# EAGLE design radio_r3 (EAGLE 9.6.2)
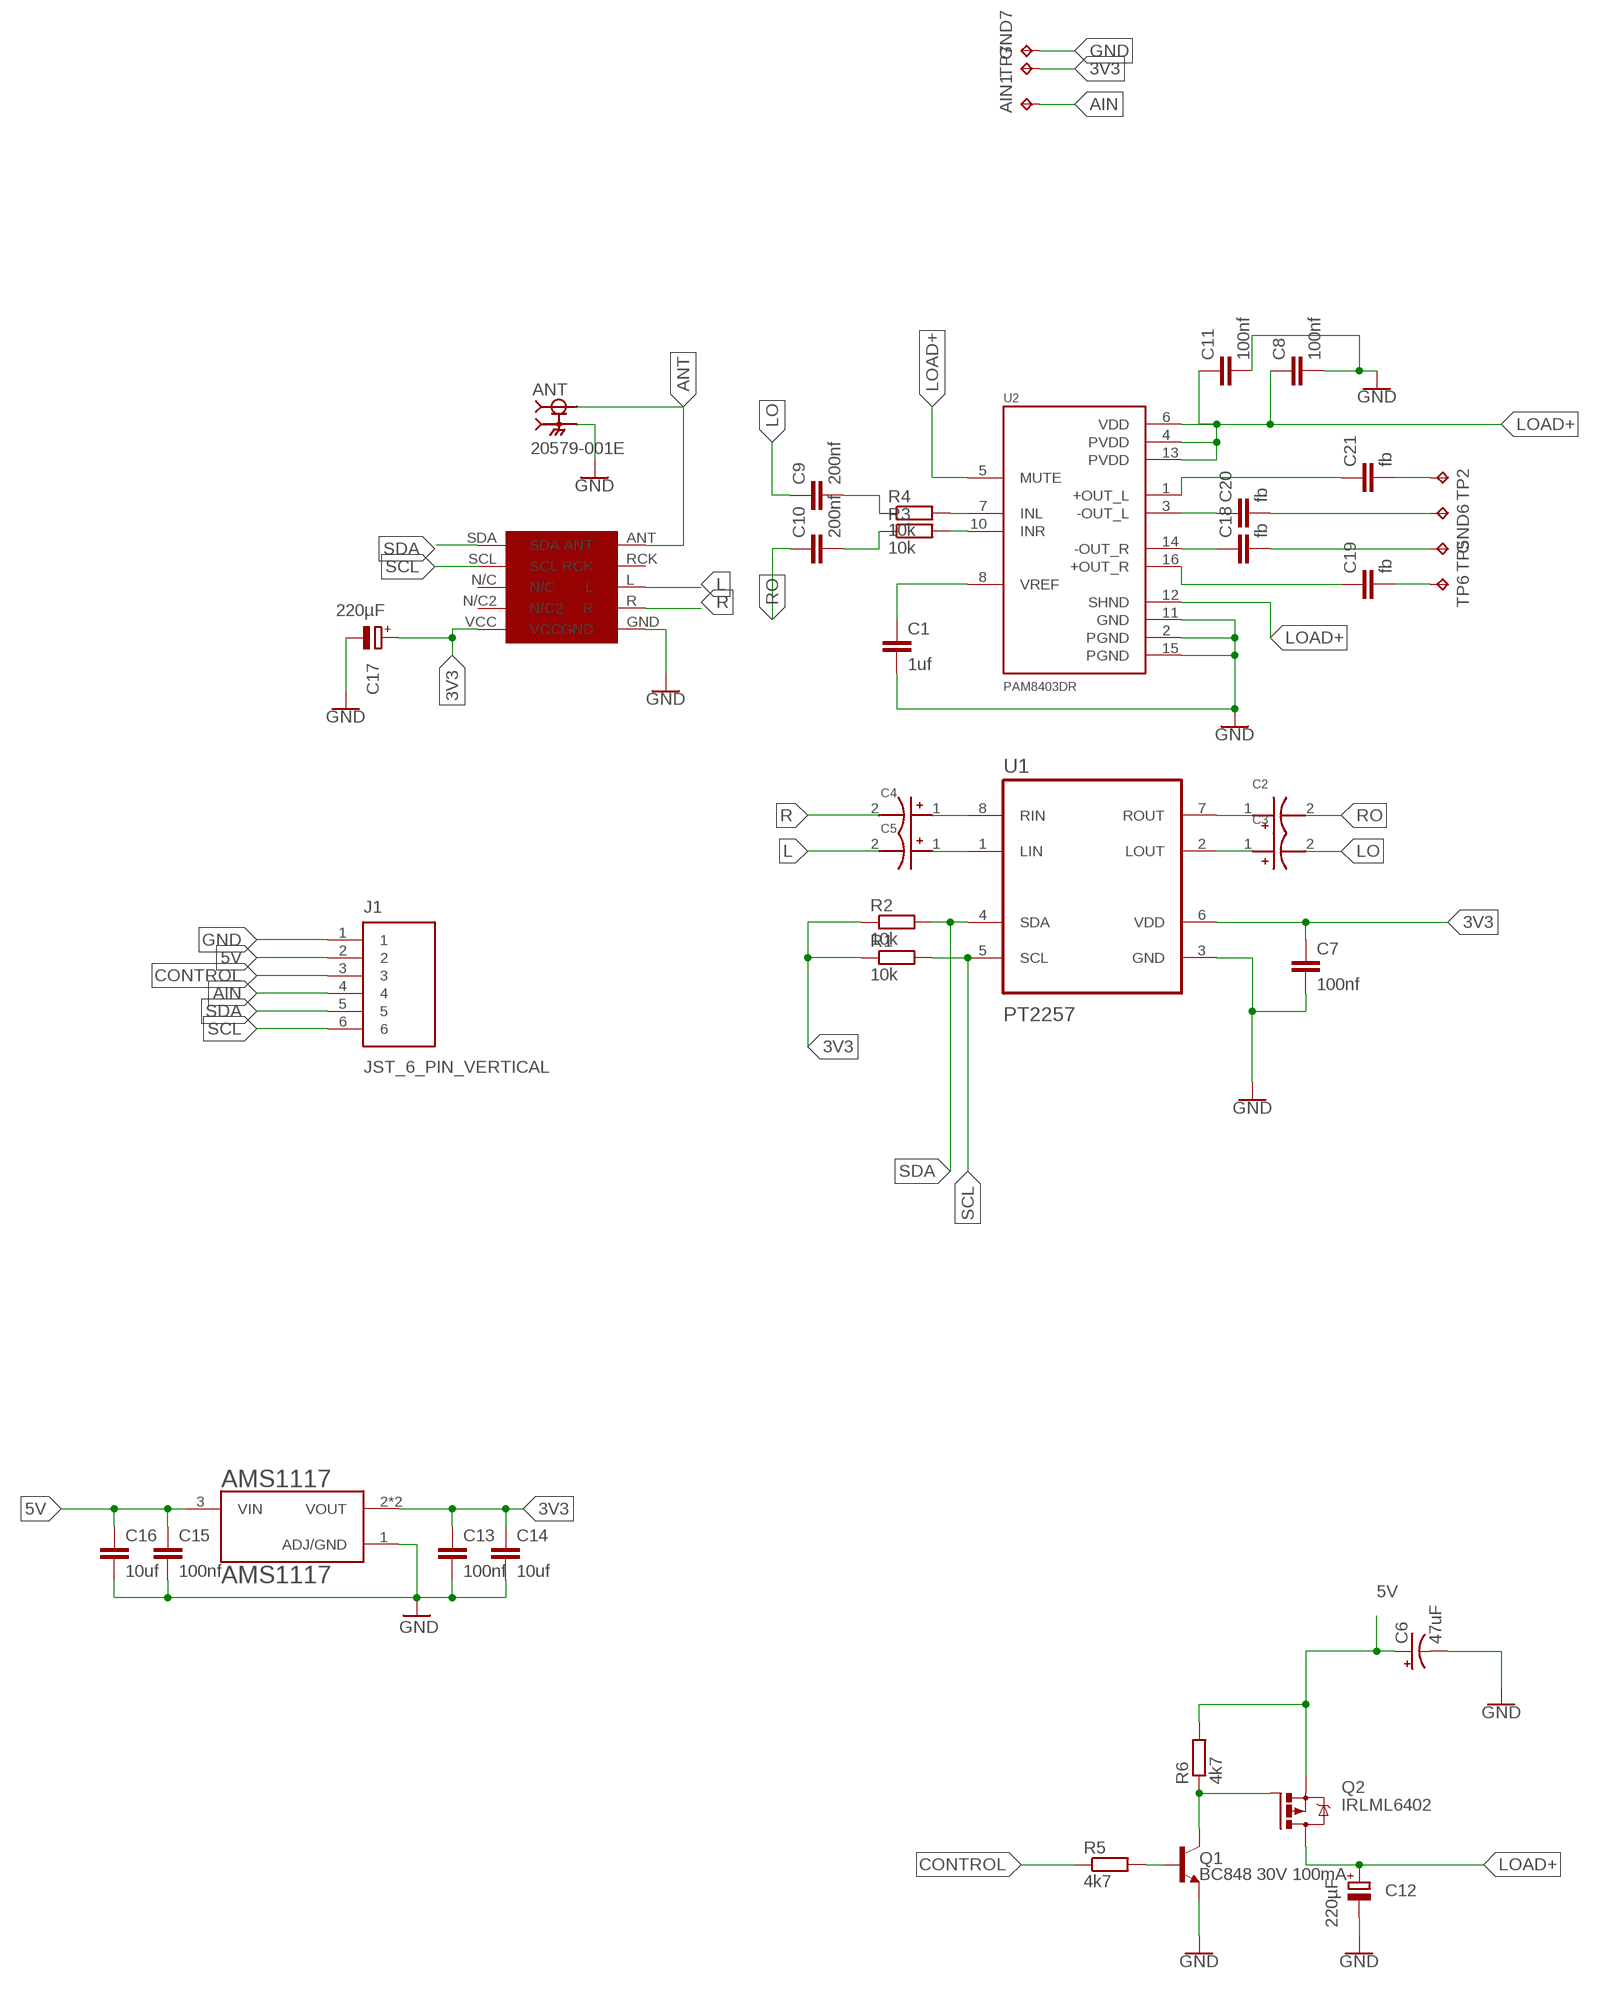
[diagram p0: schematic, sheet 1]

## Parts
AIN1  TPTP10SQ  [TP10SQ]
AMS1117  AMS1117  [SOT229P700X180-4N]
ANT  20579-001E  [IPEX_20579-001E]
C1  1uf  C-EUC0805  [C0805]
C2  10uf  TAJA106M010RNJ  [CAPMP3216X180N]
C3  10uf  TAJA106M010RNJ  [CAPMP3216X180N]
C4  10uf  TAJA106M010RNJ  [CAPMP3216X180N]
C5  10uf  TAJA106M010RNJ  [CAPMP3216X180N]
C6  47uF  47UF-POLAR-EIA3528-10V-10%  [EIA3528]
C7  100nf  C-EUC0603  [C0603]
C8  100nf  C-EUC0805  [C0805]
C9  200nf  C-EUC0805  [C0805]
C10  200nf  C-EUC0805  [C0805]
C11  100nf  C-EUC0805  [C0805]
C12  220µF  CPOL-EUD  [PANASONIC_D]
C13  100nf  C-EUC0603  [C0603]
C14  10uf  C-EUC0805  [C0805]
C15  100nf  C-EUC0603  [C0603]
C16  10uf  C-EUC0805  [C0805]
C17  220µF  CPOL-EUD  [PANASONIC_D]
C18  fb  C-EUC0805  [C0805]
C19  fb  C-EUC0805  [C0805]
C20  fb  C-EUC0805  [C0805]
C21  fb  C-EUC0805  [C0805]
GND6  TPTP15R  [TP15R]
GND7  TPTP10SQ  [TP10SQ]
J1  JST_6_PIN_VERTICAL  [JST-6-SMD-VERT-1.0MM]
Q1  BC848 30V 100mA  TRANS_NPN-MMBT2222AL  [SOT23-3]
Q2  IRLML6402  IRLML5203  [MICRO3]
R1  10k  R-EU_R0603  [R0603]
R2  10k  R-EU_R0603  [R0603]
R3  10k  R-EU_R0805  [R0805]
R4  10k  R-EU_R0805  [R0805]
R5  4k7  R-EU_R0603  [R0603]
R6  4k7  R-EU_R0603  [R0603]
RDA5807M  RDA  [RDA]
TP2  TPTP15R  [TP15R]
TP5  TPTP15R  [TP15R]
TP6  TPTP15R  [TP15R]
TP7  TPTP10SQ  [TP10SQ]
U1  PT2257  [SOIC127P600X175-8N]
U2  PAM8403DR  [SOIC127P605X150-16N]

## Nets
3V3: AMS1117.2(VOUT) AMS1117.4(VOUT) C7.1 C13.1 C14.1 C17.+ R1.1 R2.1 RDA5807M.VCC TP7.TP U1.6(VDD)
5V: AMS1117.3(VIN) C6.A(+) C15.1 C16.1 J1.2 Q2.2(S) R6.2
AIN: AIN1.TP J1.4
ANT: ANT.1(SIGNAL) RDA5807M.ANT
CONTROL: J1.3 R5.1
GND: AMS1117.1(ADJ/GND) ANT.G1(GROUND) ANT.G2(GROUND) ANT.G3(GROUND) C1.2 C6.C(-) C7.2 C8.2 C11.2 C12.- C13.2 C14.2 C15.2 C16.2 C17.- GND7.TP J1.1 Q1.2(E) RDA5807M.GND U1.3(GND) U2.2(PGND) U2.11(GND) U2.15(PGND)
L: C5.2 RDA5807M.L
LO: C3.2 C9.1
LOAD+: C8.1 C11.1 C12.+ Q2.3(D) U2.4(PVDD) U2.5(MUTE) U2.6(VDD) U2.12(SHND) U2.13(PVDD)
N$1: Q1.1(B) R5.2
N$2: Q1.3(C) Q2.1(G) R6.1
N$3: C2.1 U1.7(ROUT)
N$4: C3.1 U1.2(LOUT)
N$5: C1.1 U2.8(VREF)
N$6: C21.1 U2.1(+OUT_L)
N$7: C4.1 U1.8(RIN)
N$8: C5.1 U1.1(LIN)
N$9: C20.1 U2.3(-OUT_L)
N$10: C18.1 U2.14(-OUT_R)
N$11: C19.1 U2.16(+OUT_R)
N$12: R4.2 U2.7(INL)
N$13: R3.2 U2.10(INR)
N$14: C9.2 R4.1
N$15: C10.2 R3.1
N$16: C19.2 TP6.TP
N$17: C18.2 TP5.TP
N$18: C20.2 GND6.TP
N$19: C21.2 TP2.TP
R: C4.2 RDA5807M.R
RO: C2.2 C10.1
SCL: J1.6 R1.2 RDA5807M.SCL U1.5(SCL)
SDA: J1.5 R2.2 RDA5807M.SDA U1.4(SDA)
Unconnected: RDA5807M.N/C RDA5807M.N/C2 RDA5807M.RCK

## Library data of the parts
AIN1 GND6 GND7 TP2 TP5-TP7 = testpad:TP: Test pad
AMS1117 = AMS1117:AMS1117: Sot223/Pkg 1-Amp 5-Volt Low Drop Out Voltage Regulatator; AVAILABILITY: Unavailable; DESCRIPTION: 1A LOW DROPOUT VOLTAGE REGULATOR SOT-223; MF: Advanced Monolithic Systems; MP: AMS1117; PACKAGE: SOT-223 Seeed Technology; PRICE: None
ANT = 20579-001E:20579-001E: MHF 4L RECEPTACLE Check availability <https://pricing.snapeda.com/parts/20579-001E/I-PEX/view-part?ref=eda>; AVAILABILITY: In Stock; DESCRIPTION: 1 POS Vertical SMD Coaxial connector M.2 industry standard with a mated height of 1.4 mm and support up to 12 GHz MHF 4L Receptacle; MF: I-PEX; MP: 20579-001E; PACKAGE: None; PRICE: None; PURCHASE-URL: https://pricing.snapeda.com/search/part/20579-001E/?ref=eda
C1 C7-C11 C18-C21 = rcl:C-EU: CAPACITOR, European symbol; SPICEPREFIX: C
C2-C5 = TAJA106M010RNJ:TAJA106M010RNJ: 1µF Molded Tantalum Capacitors 16V 1206 (3216 Metric) 11Ohm @ 100kHz Check availability <https://pricing.snapeda.com/parts/TAJA106M010RNJ/AVX/view-part?ref=eda>; AVAILABILITY: In Stock; DESCRIPTION: 10 µF Molded Tantalum Capacitors 10 V 1206 (3216 Metric) 3Ohm; MF: AVX; MP: TAJA106M010RNJ; PACKAGE: 1206 AVX; PRICE: None; PURCHASE-URL: https://pricing.snapeda.com/search/part/TAJA106M010RNJ/?ref=eda
C6 = SparkFun-Capacitors:47UF-POLAR: 47µF polarized capacitors A capacitor is a passive two-terminal electrical component used to store electrical energy temporarily in an electric field.; PROD_ID: CAP-08310
C12 C17 = rcl:CPOL-EU: POLARIZED CAPACITOR, European symbol; SPICEPREFIX: C
C13-C16 = resistor:C-EU: CAPACITOR, European symbol
J1 = SparkFun-Connectors:JST_6_PIN_VERTICAL: JST 6 pin vertical connector Here is a six pin vertical 1.0mm pitch connector. It is useful if you need something very tiny as a connection. These are not the standard JST type connectors we use on most of our boards, but are actually the much smaller JST-SH type. Here is the connector we sell at SparkFun: JST SH Vertical 6-Pin Connector - SMD <https://www.sparkfun.com/products/579> (GPS-00579) Datasheet <http://www.sparkfun.com/datasheets/GPS/EM406-SMDConnector-eSH.pdf> It was used on these SparkFun products: SparkFun GPS Breakout <https://www.sparkfun.com/products/11818> (BOB-11818) SparkFun Weather Shield <https://www.sparkfun.com/products/12081> (DEV-12081) And many, many other GPS related products.; PROD_ID: CONN-08249; SF_ID: GPS-00579
Q1 = SparkFun-DiscreteSemi:TRANS_NPN: NPN transistor Current controlled devices typically used to amplify current or used as a switch. BC547 - COM-08928 <http://www.sparkfun.com/products/8928> (TO-92 45V 100mA) (1.Collector 2.Base 3.Emitter) 2N3904 - COM-00521 <http://www.sparkfun.com/products/521> (TO-92 40V 200mA) (1.Emitter 2.Base 3.Collector) P2N2222A - COM-12852 <http://www.sparkfun.com/products/12852> (TO-92 40V 600mA) (1.Collector 2.Base 3.Emitter); PROD_ID: TRANS-08049; VALUE: 600mA/40V
Q2 = transistor-power:IRLML5203: HEXFET P-Channel Power MOSFET
R1-R6 = resistor:R-EU_: RESISTOR, European symbol
RDA5807M = RDA:RDA
U1 = PT2257:PT2257: Check availability <https://pricing.snapeda.com/parts/NE555PS/Texas%20Instruments/view-part?ref=eda>; AVAILABILITY: In Stock; DESCRIPTION: Single Precision Timer; MF: Texas Instruments; MP: NE555PS; PACKAGE: SOP-8 Texas Instruments; PRICE: None; PURCHASE-URL: https://pricing.snapeda.com/search/part/NE555PS/?ref=eda
U2 = PAM8403DR:PAM8403DR: Audio Amp Speaker 2-CH Stereo Class-D 16-Pin SOP T/R Check prices <https://pricing.snapeda.com/parts/PAM8403DR/Diodes%20Inc./view-part?ref=eda>; AVAILABILITY: Good; DESCRIPTION: Amplifier IC 2-Channel (Stereo) Class D 16-SOP; MF: Diodes Inc.; MP: PAM8403DR; PACKAGE: SOP-16 Diodes Inc.; PRICE: None; PURCHASE-URL: https://pricing.snapeda.com/search/part/PAM8403DR/?ref=eda

## Net classes
0 default: width 0.279 mm, clearance 0.229 mm

## Board
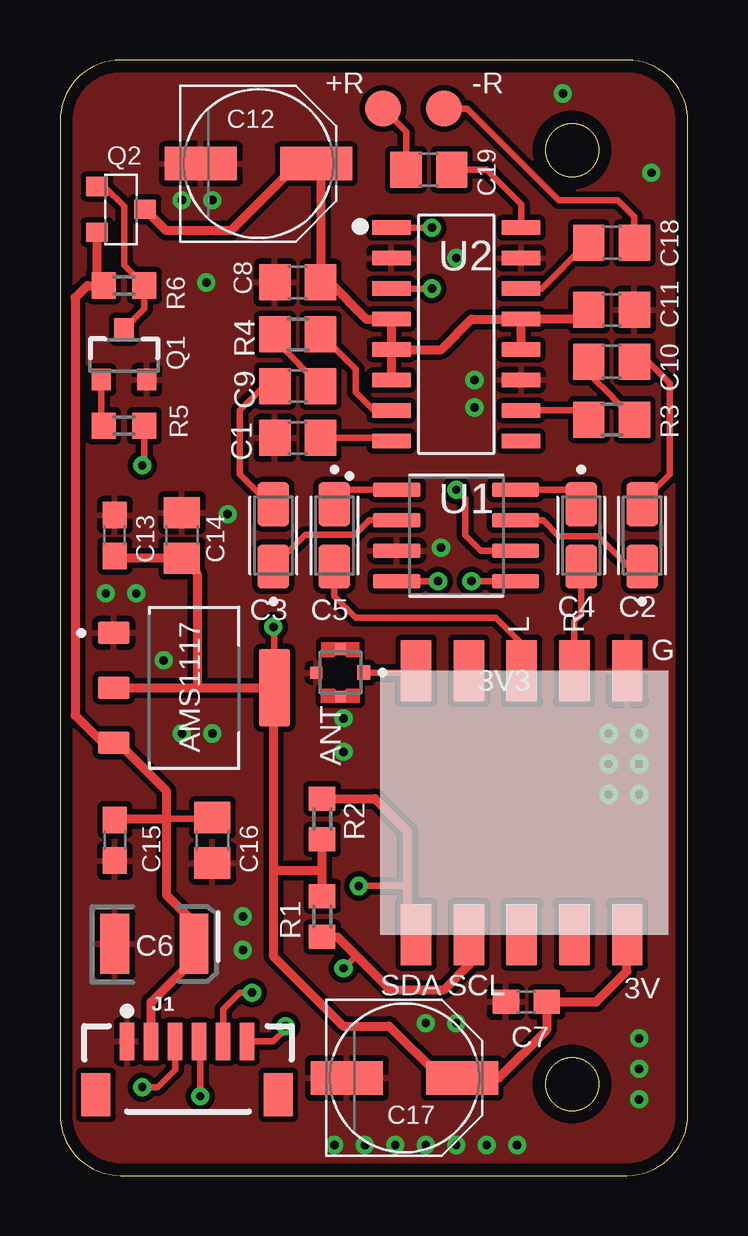
[diagram p1: board, top side]
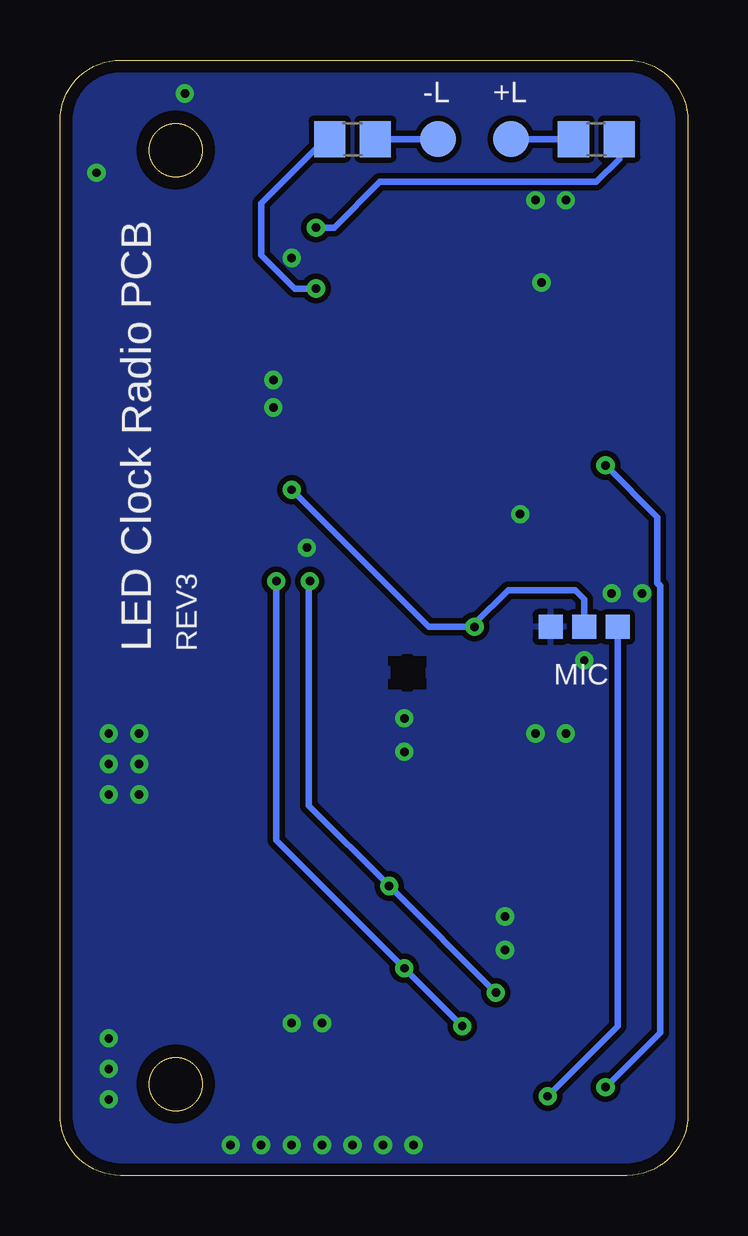
[diagram p2: board, bottom side, seen from below]

Size 26.16 x 46.48 mm. Coordinates in mm from the lower left corner, seen from the top.
Outline: 0,43.94 0,2.54 arc90 2.54,0 23.62,0 arc90 26.16,2.54 26.16,43.94 arc90 23.62,46.48 2.54,46.48 arc90 0,43.94
Outline: circle at 21.34,42.72 radius 1.1
Outline: circle at 21.34,3.81 radius 1.1
Copper layers (1*16): Top 0.035mm / dielectric 1.5mm / Bottom 0.035mm
Design rules "default *": minimum track width 6mil, minimum drill 0.35mm, track to track 6mil, track to pad 6mil, pad to pad 6mil, via to via 6mil, smd to smd 6mil, copper to edge 20mil, drill to drill 6mil, minimum pad ring 10mil, minimum via ring 8mil, stop-mask expansion 4mil, vias tented up to drill 2mm, thermal gap 10mil

### Footprints (pad centres in the part's own frame; a part is rotated, then mirrored left to right if it is on the bottom)
TP10SQ = smd 1 x 1: TP 0,0
SOT229P700X180-4N = smd 1.31 x 0.93: 1 -3.345,2.29; 2 -3.345,0; 3 -3.345,-2.29 | smd 1.31 x 3.24: 4 3.345,0
IPEX_20579-001E = smd 0.6 x 0.55: 1 0,-0.975 | smd 0.45 x 0.45: G1 -1,0; G3 1,0 | smd 0.5 x 0.5: G2 0,1
C0805 = smd 1.3 x 1.5: 1 -0.95,0; 2 0.95,0
CAPMP3216X180N = smd 1.81 x 1.32: 1 -1.3,0; 2 1.3,0
EIA3528 = smd 1.2 x 2.5: A 1.65,0; C -1.65,0
C0603 = smd 1.1 x 1: 1 -0.85,0; 2 0.85,0
PANASONIC_D = smd 3 x 1.4: + 2.4,0; - -2.4,0
TP15R = smd 1.5 x 1.5: TP 0,0
JST-6-SMD-VERT-1.0MM = smd 0.6 x 1.55: 1 -2.54,1.27; 2 -1.54,1.27; 3 -0.54,1.27; 4 0.46,1.27; 5 1.46,1.27; 6 2.46,1.27 | smd 1.2 x 1.8: P$1 -3.84,-0.955; P$2 3.76,-0.955
SOT23-3 = smd 0.8 x 0.9: 1 -0.95,-1; 2 0.95,-1; 3 0,1.1
MICRO3 = smd 0.8 x 0.9: 1 -0.95,-1; 2 0.95,-1; 3 0,1
R0603 = smd 1 x 1.1: 1 -0.85,0; 2 0.85,0
R0805 = smd 1.3 x 1.5: 1 -0.95,0; 2 0.95,0
RDA = smd 2.54 x 1.27: ANT 11,-1.5; GND 11,-10.3; L 11,-5.9; N/C 0,-5.9; N/C2 0,-8.1; R 11,-8.1; RCK 11,-3.7; SCL 0,-3.7; SDA 0,-1.5; VCC 0,-10.3
SOIC127P600X175-8N = smd 1.97 x 0.6: 1 -2.475,1.905; 2 -2.475,0.635; 3 -2.475,-0.635; 4 -2.475,-1.905; 5 2.475,-1.905; 6 2.475,-0.635; 7 2.475,0.635; 8 2.475,1.905
SOIC127P605X150-16N = smd 1.6 x 0.6: 1 -2.7,4.445; 2 -2.7,3.175; 3 -2.7,1.905; 4 -2.7,0.635; 5 -2.7,-0.635; 6 -2.7,-1.905; 7 -2.7,-3.175; 8 -2.7,-4.445; 9 2.7,-4.445; 10 2.7,-3.175; 11 2.7,-1.905; 12 2.7,-0.635; 13 2.7,0.635; 14 2.7,1.905; 15 2.7,3.175; 16 2.7,4.445

### Placement (x,y rotation side)
AIN1  2.92,22.86 180 bottom
AMS1117  5.59,20.32 0 top
ANT  11.68,20.95 90 top
C1  9.91,30.73 180 top
C2  24.26,26.67 90 top
C3  8.89,26.67 90 top
C4  21.72,26.67 270 top
C5  11.43,26.67 270 top
C6  3.94,9.65 0 top
C7  19.43,7.24 180 top
C8  9.91,37.21 180 top
C9  9.91,32.89 0 top
C10  22.99,33.91 180 top
C11  22.99,36.07 0 top
C12  8.27,42.16 0 top
C13  2.29,26.67 90 top
C14  5.08,26.67 90 top
C15  2.29,13.97 270 top
C16  6.35,13.97 270 top
C17  14.35,4.06 0 top
C18  22.99,38.86 0 top
C19  15.37,41.91 180 top
C20  13.97,43.18 0 bottom
C21  3.81,43.18 180 bottom
GND6  10.41,43.18 0 bottom
GND7  5.71,22.86 180 bottom
J1  5.33,4.32 0 top
Q1  2.67,34.16 0 top
Q2  2.54,40.26 270 top
R1  10.92,10.79 270 top
R2  10.92,14.86 90 top
R3  22.99,31.5 180 top
R4  9.91,35.05 0 top
R5  2.67,31.24 180 top
R6  2.67,37.08 180 top
RDA5807M  13.34,10.03 90 top
TP2  7.37,43.18 0 bottom
TP5  16,44.45 0 top
TP6  13.46,44.45 0 top
TP7  4.32,22.86 180 bottom
U1  16.51,26.67 0 top
U2  16.51,35.05 0 top

### Tracks (layer width: path | path; a pad name or v marks a point on that pad's centre or on a via)
3V3  (via drill 0.35)
  Top 0.279: v16.51,28.57 16.89,28.19 16.89,26.67 17.53,26.04 U1.6 | AMS1117.4 8.93,22.82 v8.89,22.86
  Top 0.381: AMS1117.2 5.71,20.32 | 5.71,20.32 AMS1117.4 8.89,20.28 8.89,12.83 | R1.1 10.92,12.7 | 10.92,12.7 R2.1 | 10.92,12.7 9.02,12.7 8.89,12.83 | 8.89,12.83 8.89,9.14 11.81,6.22 13.72,6.22 15.88,4.06 C17.+ 18.29,4.06 20.28,6.06 C7.1 22.35,7.24 23.62,8.51 RDA5807M.VCC | 5.71,20.32 5.71,25.09 C14.1 2.39,25.72 C13.1
  Bottom 0.279: v16.51,28.57 10.79,22.86 v8.89,22.86 8.89,22.99 7.49,24.38 4.7,24.38 4.32,24 TP7.TP
5V
  Top 0.279: C16.1 6.29,14.86 4.45,14.86 4.51,14.92 4.51,14.93 4.45,14.99
  Top 0.381: J1.2 3.79,7.22 5.59,9.02 C6.A 5.59,10.54 4.45,11.68 4.45,14.86 2.32,14.86 C15.1 | 4.45,14.99 4.45,16 2.42,18.03 AMS1117.3 1.78,18.03 0.63,19.18 0.63,36.58 1.14,37.08 R6.2 1.54,37.36 Q2.2
AIN  (via drill 0.35)
  Top 0.279: J1.4 5.84,5.54 v5.84,3.3
  Bottom 0.279: v5.84,3.3 2.92,6.22 AIN1.TP
ANT
  Top 0.279: RDA5807M.ANT 14.76,20.95 ANT.1
CONTROL  (via drill 0.35)
  Top 0.279: R5.1 3.52,29.68 v3.43,29.59 | v3.43,3.68 4.06,3.68 4.79,4.41 J1.3
  Bottom 0.279: v3.43,29.59 1.27,27.43 1.27,24.68 1.16,24.57 1.16,5.95 v3.43,3.68
GND  (via drill 0.35)
  other vias: 11.43,1.27 12.7,1.27 13.97,1.27 15.24,1.27 16.51,1.27 17.78,1.27 19.05,1.27 16.51,6.35 15.24,6.35 7.62,9.4 7.62,10.79 6.35,18.41 5.08,18.41 4.32,21.46 6.98,27.56 11.81,19.05 11.81,17.65 24.13,5.71 24.13,4.45 24.13,3.17 6.1,37.21 6.35,40.64 5.08,40.64 24.13,18.41 22.86,18.41 22.86,17.14 24.13,17.14 24.13,15.88 22.86,15.88 24.64,41.78 16.51,38.23 20.95,45.09 17.27,33.15 17.27,32 1.91,24.26 3.18,24.26 15.88,26.16
  pour Top: -2.54,46.99 -2.54,-2.54 30.48,-2.54 30.48,46.99
  pour Bottom: -2.54,46.99 26.67,46.99 26.67,0 -2.54,0
L
  Top 0.279: C5.2 11.43,24.13 12.32,23.24 18.16,23.24 19.23,22.17 RDA5807M.L
LO
  Top 0.279: C3.2 8.73,27.97 7.49,29.21 7.49,31.88 8.51,32.89 C9.1
LOAD+
  Top 0.381: U2.5 U2.4 12.76,35.69 11.24,37.21 C8.1 10.86,41.98 C12.+ 9.91,42.16 7.11,39.37 4.43,39.37 Q2.3 | U2.5 U2.6 | C11.1 21.66,35.69 U2.13 | U2.12 U2.13 | U2.5 15.88,34.42 17.15,35.69 U2.13
N$1
  Top 0.279: Q1.1 1.72,31.34 R5.2
N$2
  Top 0.279: Q2.1 1.84,41.21 2.67,40.39 2.67,37.93 R6.1 3.52,36.11 Q1.3
N$3
  Top 0.279: U1.7 20.13,27.3 20.79,26.64 22.43,26.64 23.71,25.37 C2.1
N$4
  Top 0.279: U1.2 12.88,27.3 12.27,26.7 10.22,26.7 C3.1
N$5
  Top 0.279: C1.1 13.68,30.73 U2.8
N$6  (via drill 0.35)
  Top 0.279: U2.1 v15.49,39.5
  Bottom 0.279: v15.49,39.5 14.73,39.5 12.83,41.4 3.81,41.4 2.86,42.35 C21.1
N$7
  Top 0.279: U1.8 21.11,28.57 C4.1
N$8
  Top 0.279: C5.1 12.03,28.57 U1.1
N$9  (via drill 0.35)
  Top 0.279: U2.3 v15.49,36.96
  Bottom 0.279: v15.49,36.96 16.38,36.96 17.78,38.35 17.78,40.51 15.11,43.18 C20.1
N$10
  Top 0.279: U2.14 20.07,36.96 21.97,38.86 C18.1
N$11
  Top 0.279: C19.1 17.78,41.91 19.21,40.48 U2.16
N$12
  Top 0.279: R4.2 12.32,33.59 12.32,32.64 13.08,31.88 U2.7
N$13
  Top 0.279: U2.10 21.66,31.88 R3.2
N$14
  Top 0.279: C9.2 9.97,33.77 9.97,33.8 8.96,34.81 R4.1
N$15
  Top 0.279: R3.1 23.05,32.38 23.05,32.4 22.04,33.42 C10.2
N$16
  Top 0.279: TP6.TP 14.42,43.49 C19.2
N$17
  Top 0.279: TP5.TP 16.97,44.45 20.78,40.64 23.24,40.64 23.94,39.94 C18.2
N$18
  Bottom 0.279: C20.2 GND6.TP
N$19
  Bottom 0.279: TP2.TP C21.2
R
  Top 0.279: C4.2 21.72,23.37 21.44,23.09 RDA5807M.R
RO
  Top 0.279: C2.2 24.26,28.07 25.4,29.21 25.4,33.02 24.51,33.91 C10.1
SCL  (via drill 0.35)
  Top 0.279: J1.6 8.89,5.59 9.4,6.1 v9.4,6.22 | 10.96,9.91 R1.2 | 12.34,9.16 v11.81,8.64 12.27,9.1 12.27,9.23 | U1.5 v17.15,24.77
  Top 0.381: R1.2 11.56,9.95 12.27,9.23 12.53,8.97 | 12.34,9.16 13.76,7.75 16,7.75 17.03,8.78 RDA5807M.SCL
  Bottom 0.279: v9.4,6.22 v11.81,8.64 17.15,13.97 v17.15,24.77
SDA  (via drill 0.35)
  Top 0.279: J1.5 6.79,6.92 7.49,7.62 v8,7.62 | v12.45,12.06 14.48,12.06 | U1.4 v15.75,24.77
  Top 0.381: R2.2 13.12,15.71 14.48,14.35 14.48,12.06 14.48,10.39 RDA5807M.SDA
  Bottom 0.279: v8,7.62 v12.45,12.06 15.79,15.41 15.79,24.72 v15.75,24.77

### Text on the board
tNames: +R | -R | L | R | G | 3V3 | SDA | SCL | 3V
bNames: +L | -L | REV3 | LED Clock Radio PCB | MIC